# Altium schematic sheet MB1297_MCU2.SchDoc: STM32L475 - 2/2
size A4; DocumentNumber: MB1297; Revision: C; SheetNumber: 3; SheetTotal: 11
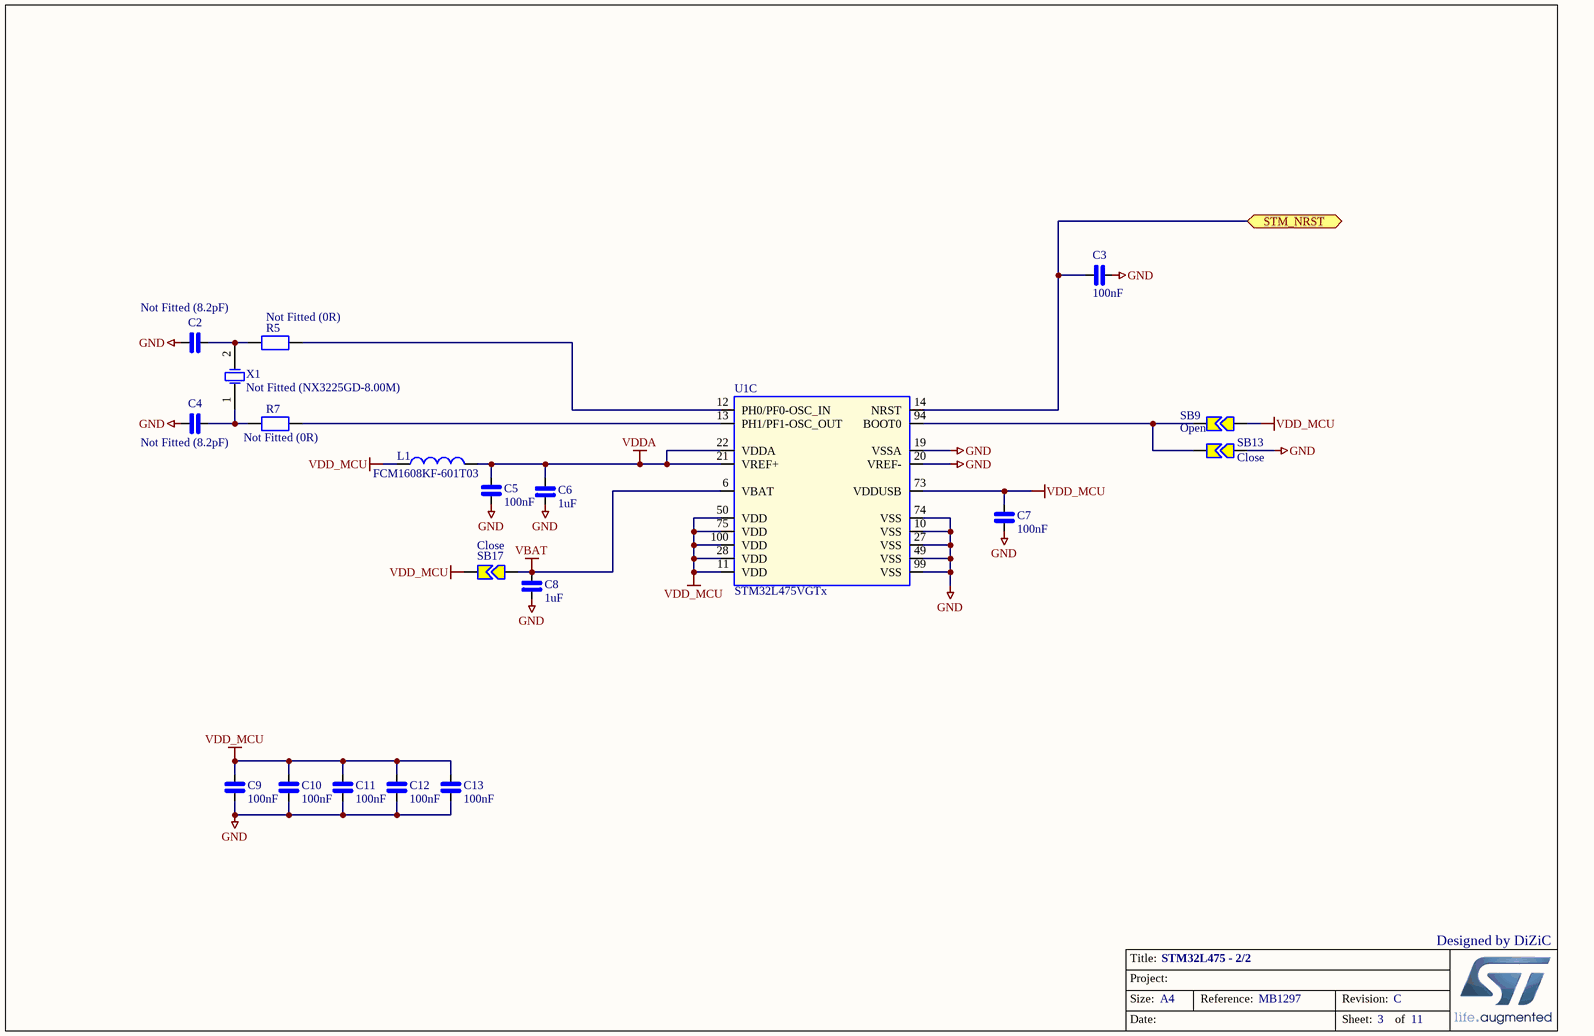
[diagram p0: MB1297_MCU2.SchDoc]

## Parts
C2  Not Fitted (8.2pF)  [0402_CAP_NPOL]
C3  100nF  [0402_CAP_NPOL]
C4  Not Fitted (8.2pF)  [0402_CAP_NPOL]
C5  100nF  [0402_CAP_NPOL]
C6  1uF  [0402_CAP_NPOL]
C7  100nF  [0402_CAP_NPOL]
C8  1uF  [0402_CAP_NPOL]
C9  100nF  [0402_CAP_NPOL]
C10  100nF  [0402_CAP_NPOL]
C11  100nF  [0402_CAP_NPOL]
C12  100nF  [0402_CAP_NPOL]
C13  100nF  [0402_CAP_NPOL]
L1  FCM1608KF-601T03  [0603L]
R5  Not Fitted (0R)  [0402_RES]
R7  Not Fitted (0R)  [0402_RES]
SB9  Open  [SB]
SB13  Close  [SB]
SB17  Close  [SB]
U1  STM32L475VGTx  [LQFP100 14x14x1.6]  (part C of 3)
X1  Not Fitted (NX3225GD-8.00M)  [CRY_NX3225GD_2P]

## Ports
STM_NRST

## Nets
GND: C2.2 C3.1 C4.2 C5.2 C6.1 C7.2 C8.1 C9.2 C10.2 C11.2 C12.2 C13.2 SB13.1 U1.10(VSS) U1.19(VSSA) U1.20(VREF-) U1.27(VSS) U1.49(VSS) U1.74(VSS) U1.99(VSS)
VBAT: C8.2 SB17.2 U1.6(VBAT)
VDD_MCU: C7.1 C9.1 C10.1 C11.1 C12.1 C13.1 L1.1 SB9.1 SB17.1 U1.11(VDD) U1.28(VDD) U1.50(VDD) U1.73(VDDUSB) U1.75(VDD) U1.100(VDD)
VDDA: C5.1 C6.2 L1.2 U1.21(VREF+) U1.22(VDDA)
STM_NRST: C3.2 U1.14(NRST) ; port STM_NRST
NetC2_1: C2.1 R5.2 X1.2(OSC2)
NetC4_1: C4.1 R7.2 X1.1(OSC1)
NetR5_1: R5.1 U1.12(PH0/PF0-OSC_IN)
NetR7_1: R7.1 U1.13(PH1/PF1-OSC_OUT)
NetSB9_2: SB9.2 SB13.2 U1.94(BOOT0)

## Notes on the sheet
- Designed by DiZiC
- Title:
- Project:
- Size:
- Date:
- A4
- Reference:
- Sheet:
- Revision:
- of

## Library data of the parts
C2-C13 = CAP_NPOL: Capacitor_not polarized
L1 = Inductor: Value: 100uH; Published: 8-Jun-2000; Revision: July-2002: Re-released for DXP Platform.; Publisher: Altium Limited
R5 R7 = RES: Resistor; FITTED: NO
SB9 SB13 SB17 = Strap2: Solder Jumper; Solder: YES; Published: 24-Mar-1999; Revision: July-2002: Re-released for DXP Platform.; Publisher: Altium Limited
X1 = XTAL_8M_NX3225GD: Crystal 8Mhz, 8pF, -+50PPM, SMD; Manuf_1: NDK; Manuf_Part_1: NX3225GD 8MHz EXS00A-CG04874; ECCN_US/EU: EAR99/NEC; NDK Ref: X3127326; Ref St: 9157029; Fitted: NO; Ordered_By: STM; Order_Code: NX3225GD 8MHz EXS00A-CG04874; Distrib: *; Value: Not Fitted (NX3225GD-8.00M)